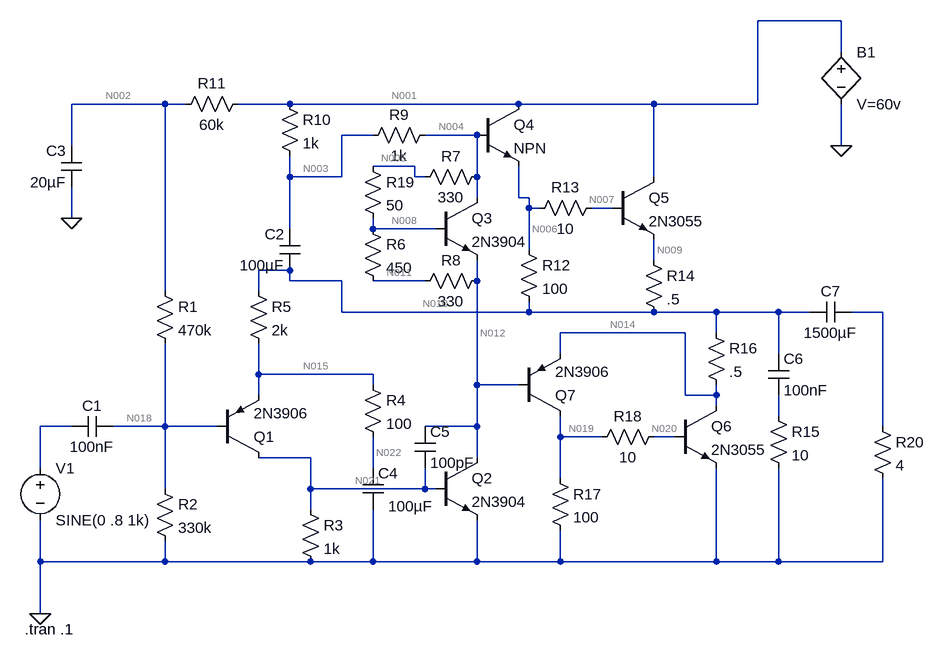
[diagram p0: schematic 2n3055-amp-60w.asc]
2n3055-amp-60w.asc, the LTspice schematic file:
Version 4
SHEET 1 888 968
WIRE 656 16 528 16
WIRE 656 64 656 16
WIRE -384 144 -528 144
WIRE -352 144 -384 144
WIRE -192 144 -272 144
WIRE 160 144 -192 144
WIRE 368 144 160 144
WIRE 528 144 528 16
WIRE 528 144 368 144
WIRE -64 192 -112 192
WIRE 96 192 16 192
WIRE -528 208 -528 144
WIRE 656 208 656 144
WIRE 0 240 -64 240
WIRE -192 256 -192 224
WIRE -112 256 -112 192
WIRE -112 256 -192 256
WIRE 0 256 0 240
WIRE 16 256 0 256
WIRE 96 256 96 192
WIRE 368 256 368 144
WIRE 96 288 96 256
WIRE 160 288 160 240
WIRE 176 288 160 288
WIRE 176 304 176 288
WIRE 192 304 176 304
WIRE 304 304 272 304
WIRE -528 320 -528 272
WIRE -192 336 -192 256
WIRE -64 336 -64 320
WIRE 32 336 -64 336
WIRE 176 368 176 304
WIRE 368 384 368 352
WIRE -192 400 -240 400
WIRE -192 416 -192 400
WIRE -112 416 -192 416
WIRE 16 416 -64 416
WIRE 96 416 96 384
WIRE -384 432 -384 144
WIRE -240 432 -240 400
WIRE -112 464 -112 416
WIRE 176 464 176 448
WIRE 176 464 -112 464
WIRE 368 464 176 464
WIRE 464 464 368 464
WIRE 560 464 464 464
WIRE 608 464 560 464
WIRE 720 464 672 464
WIRE 416 496 224 496
WIRE 464 496 464 464
WIRE 224 528 224 496
WIRE 560 528 560 464
WIRE -240 560 -240 512
WIRE -64 560 -240 560
WIRE -64 576 -64 560
WIRE 96 576 96 416
WIRE 160 576 96 576
WIRE -240 592 -240 560
WIRE 416 592 416 496
WIRE 464 592 464 576
WIRE 464 592 416 592
WIRE 464 608 464 592
WIRE 560 624 560 592
WIRE -528 640 -576 640
WIRE -384 640 -384 512
WIRE -384 640 -464 640
WIRE -304 640 -384 640
WIRE 96 640 96 576
WIRE 96 640 16 640
WIRE 720 640 720 464
WIRE 224 656 224 624
WIRE 288 656 224 656
WIRE 400 656 368 656
WIRE -160 688 -240 688
WIRE 96 688 96 640
WIRE -576 704 -576 640
WIRE -64 704 -64 656
WIRE 224 720 224 656
WIRE -384 736 -384 640
WIRE -160 736 -160 688
WIRE 16 736 16 704
WIRE 16 736 -160 736
WIRE 32 736 16 736
WIRE -160 768 -160 736
WIRE -576 848 -576 784
WIRE -384 848 -384 816
WIRE -384 848 -576 848
WIRE -160 848 -384 848
WIRE -64 848 -64 768
WIRE -64 848 -160 848
WIRE 96 848 96 784
WIRE 96 848 -64 848
WIRE 224 848 224 800
WIRE 224 848 96 848
WIRE 464 848 464 704
WIRE 464 848 224 848
WIRE 560 848 560 704
WIRE 560 848 464 848
WIRE 720 848 720 720
WIRE 720 848 560 848
WIRE -576 928 -576 848
FLAG -528 320 0
FLAG -576 928 0
FLAG 656 208 0
SYMBOL pnp -304 688 M180
SYMATTR InstName Q1
SYMATTR Value 2N3906
SYMBOL res -400 416 R0
SYMATTR InstName R1
SYMATTR Value 470k
SYMBOL res -400 720 R0
SYMATTR InstName R2
SYMATTR Value 330k
SYMBOL res -176 752 R0
SYMATTR InstName R3
SYMATTR Value 1k
SYMBOL res -80 560 R0
SYMATTR InstName R4
SYMATTR Value 100
SYMBOL res -256 416 R0
SYMATTR InstName R5
SYMATTR Value 2k
SYMBOL res -80 320 R0
SYMATTR InstName R6
SYMATTR Value 450
SYMBOL res 112 240 R90
WINDOW 0 0 56 VBottom 2
WINDOW 3 32 56 VTop 2
SYMATTR InstName R7
SYMATTR Value 330
SYMBOL res 112 400 R90
WINDOW 0 0 56 VBottom 2
WINDOW 3 32 56 VTop 2
SYMATTR InstName R8
SYMATTR Value 330
SYMBOL res 32 176 R90
WINDOW 0 0 56 VBottom 2
WINDOW 3 32 56 VTop 2
SYMATTR InstName R9
SYMATTR Value 1k
SYMBOL cap -464 624 R90
WINDOW 0 0 32 VBottom 2
WINDOW 3 32 32 VTop 2
SYMATTR InstName C1
SYMATTR Value 100nF
SYMBOL cap -176 400 R180
WINDOW 0 24 56 Left 2
WINDOW 3 24 8 Left 2
SYMATTR InstName C2
SYMATTR Value 100µF
SYMBOL cap -512 272 R180
WINDOW 0 24 56 Left 2
WINDOW 3 24 8 Left 2
SYMATTR InstName C3
SYMATTR Value 20µF
SYMBOL res -208 128 R0
SYMATTR InstName R10
SYMATTR Value 1k
SYMBOL res -256 128 R90
WINDOW 0 0 56 VBottom 2
WINDOW 3 32 56 VTop 2
SYMATTR InstName R11
SYMATTR Value 60k
SYMBOL cap -80 704 R0
WINDOW 3 39 59 Left 2
SYMATTR Value 100µF
SYMATTR InstName C4
SYMBOL npn 32 688 R0
SYMATTR InstName Q2
SYMATTR Value 2N3904
SYMBOL cap 0 640 R0
SYMATTR InstName C5
SYMATTR Value 100pF
SYMBOL npn 32 288 R0
SYMATTR InstName Q3
SYMATTR Value 2N3904
SYMBOL npn 96 144 R0
SYMATTR InstName Q4
SYMBOL npn 304 256 R0
SYMATTR InstName Q5
SYMATTR Value 2N3055
SYMBOL res 160 352 R0
SYMATTR InstName R12
SYMATTR Value 100
SYMBOL res 288 288 R90
WINDOW 0 0 56 VBottom 2
WINDOW 3 32 56 VTop 2
SYMATTR InstName R13
SYMATTR Value 10
SYMBOL res 352 368 R0
SYMATTR InstName R14
SYMATTR Value .5
SYMBOL res 544 608 R0
SYMATTR InstName R15
SYMATTR Value 10
SYMBOL cap 544 528 R0
SYMATTR InstName C6
SYMATTR Value 100nF
SYMBOL res 448 480 R0
SYMATTR InstName R16
SYMATTR Value .5
SYMBOL npn 400 608 R0
SYMATTR InstName Q6
SYMATTR Value 2N3055
SYMBOL pnp 160 624 M180
SYMATTR InstName Q7
SYMATTR Value 2N3906
SYMBOL res 208 704 R0
SYMATTR InstName R17
SYMATTR Value 100
SYMBOL res 384 640 R90
WINDOW 0 0 56 VBottom 2
WINDOW 3 32 56 VTop 2
SYMATTR InstName R18
SYMATTR Value 10
SYMBOL bv 656 48 R0
SYMATTR InstName B1
SYMATTR Value V=60v
SYMBOL res -80 224 R0
SYMATTR InstName R19
SYMATTR Value 50
SYMBOL res 704 624 R0
SYMATTR InstName R20
SYMATTR Value 4
SYMBOL voltage -576 688 R0
WINDOW 123 0 0 Left 2
WINDOW 39 0 0 Left 2
SYMATTR InstName V1
SYMATTR Value SINE(0 .8 1k)
SYMBOL cap 672 448 R90
WINDOW 0 0 32 VBottom 2
WINDOW 3 32 32 VTop 2
SYMATTR InstName C7
SYMATTR Value 1500µF
TEXT -600 952 Left 2 !.tran .1

The netlist it stands for:
* 2n3055-amp-60w.asc
Q1 N021 N018 N015 0 2N3906
R1 N002 N018 470k
R2 N018 0 330k
R3 N021 0 1k
R4 N015 N022 100
R5 N010 N015 2k
R6 N008 N011 450
R7 N004 N005 330
R8 N012 N011 330
R9 N004 N003 1k
C1 N018 N017 100nF
C2 N010 N003 100µF
C3 0 N002 20µF
R10 N001 N003 1k
R11 N001 N002 60k
C4 N022 0 100µF
Q2 N012 N021 0 0 2N3904
C5 N012 N021 100pF
Q3 N004 N008 N012 0 2N3904
Q4 N001 N004 N006 0 NPN
Q5 N001 N007 N009 0 2N3055
R12 N006 N010 100
R13 N007 N006 10
R14 N009 N010 .5
R15 N016 0 10
C6 N010 N016 100nF
R16 N010 N014 .5
Q6 N014 N020 0 0 2N3055
Q7 N019 N012 N014 0 2N3906
R17 N019 0 100
R18 N020 N019 10
B1 N001 0 V=60v
R19 N005 N008 50
R20 N013 0 4
V1 N017 0 SINE(0 .8 1k)
C7 N013 N010 1500µF
.model NPN NPN
.model PNP PNP
.lib standard.bjt
.tran .1
.backanno
.end

* Results of the author's LTspice run, read from the files saved beside the schematic
* Operating Point, zero values left out:
*   V(n021) = 725.5 mV
*   V(n018) = 23.66 V
*   V(n015) = 24.31 V
*   V(n002) = 55.89 V
*   V(n022) = 24.31 V
*   V(n010) = 25.85 V
*   V(n008) = 26.32 V
*   V(n011) = 25.9 V
*   V(n004) = 26.7 V
*   V(n005) = 26.37 V
*   V(n012) = 25.59 V
*   V(n003) = 43.35 V
*   V(n001) = 60 V
*   V(n006) = 25.93 V
*   V(n007) = 25.93 V
*   V(n009) = 25.85 V
*   V(n014) = 25.85 V
*   V(n020) = 1.016 µV
*   V(n019) = 926.5 nV
*   I(B1) = -17.49 mA
*   Ic(Q6) = 32.64 nA
*   Ib(Q6) = -8.936 nA
*   Ie(Q6) = -23.7 nA
*   Ic(Q5) = 481.7 nA
*   Ib(Q5) = -2.793 nA
*   Ie(Q5) = -478.9 nA
*   Ic(Q4) = 766.5 µA
*   Ib(Q4) = 7.665 µA
*   Ie(Q4) = -774.1 µA
*   Ic(Q3) = 15.65 mA
*   Ib(Q3) = 54.01 µA
*   Ie(Q3) = -15.71 mA
*   Ic(Q2) = 16.64 mA
*   Ib(Q2) = 45.91 µA
*   Ie(Q2) = -16.69 mA
*   Ic(Q7) = -329.8 pA
*   Ib(Q7) = 24.12 pA
*   Ie(Q7) = 305.7 pA
*   Ic(Q1) = -771.4 µA
*   Ib(Q1) = -3.142 µA
*   Ie(Q1) = 774.6 µA
*   I(R19) = 989.7 µA
*   I(R18) = 8.936 nA
*   I(R17) = 9.265 nA
*   I(R16) = 32.94 nA
*   I(R14) = 478.9 nA
*   I(R13) = 2.793 nA
*   I(R12) = 774.1 µA
*   I(R11) = 68.56 µA
*   I(R10) = 16.65 mA
*   I(R9) = -16.65 mA
*   I(R8) = -935.7 µA
*   I(R7) = 989.7 µA
*   I(R6) = 935.7 µA
*   I(R5) = 774.6 µA
*   I(R3) = 725.5 µA
*   I(R2) = 71.7 µA
*   I(R1) = 68.56 µA